# EAGLE schematic sa_io (EAGLE 9.5.1)
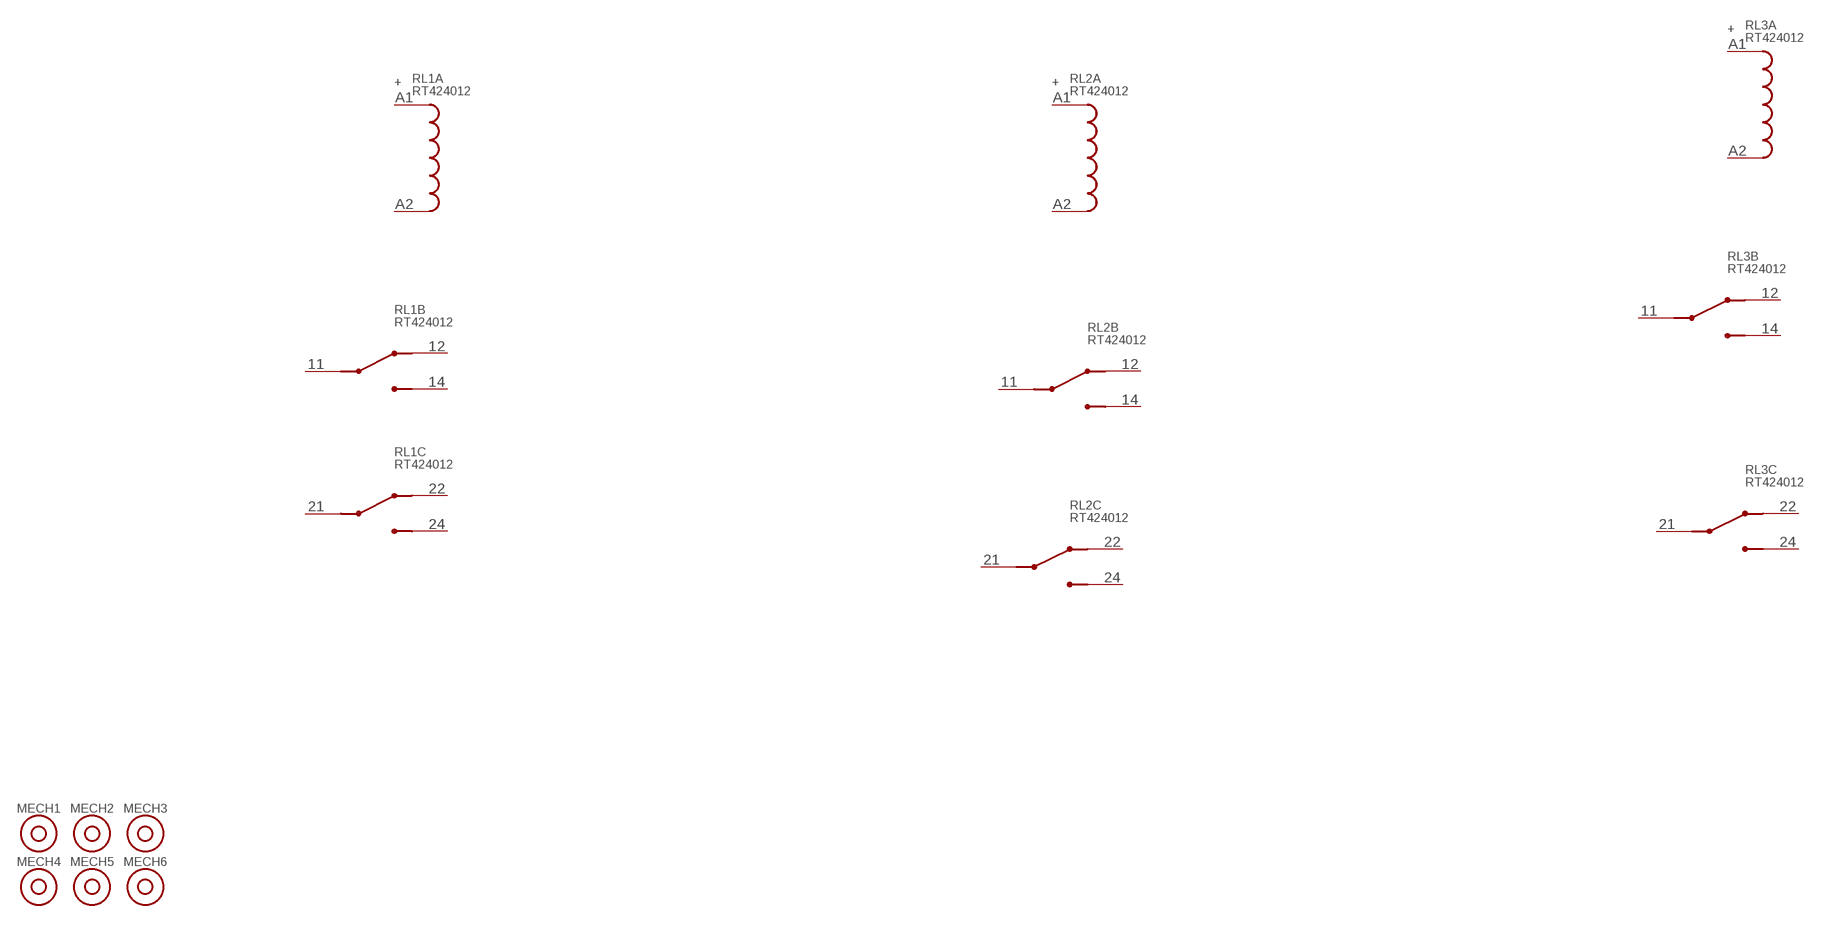
[diagram p0: schematic, sheet 1]

## Parts
MECH1  6mm x 3mm  MOUNTHOLE  [MOUNTHOLE_6X3]
MECH2  6mm x 3mm  MOUNTHOLE  [MOUNTHOLE_6X3]
MECH3  6mm x 3mm  MOUNTHOLE  [MOUNTHOLE_6X3]
MECH4  6mm x 3mm  MOUNTHOLE  [MOUNTHOLE_6X3]
MECH5  6mm x 3mm  MOUNTHOLE  [MOUNTHOLE_6X3]
MECH6  6mm x 3mm  MOUNTHOLE  [MOUNTHOLE_6X3]
RL1  RT424012  [30MMDPDTRELAY]
RL2  RT424012  [30MMDPDTRELAY]
RL3  RT424012  [30MMDPDTRELAY]
Unconnected: RL1.11 RL1.12 RL1.14 RL1.21 RL1.22 RL1.24 RL1.A1(A:A1) RL1.A2(A:A2) RL2.11 RL2.12 RL2.14 RL2.21 RL2.22 RL2.24 RL2.A1(A:A1) RL2.A2(A:A2) RL3.11 RL3.12 RL3.14 RL3.21 RL3.22 RL3.24 RL3.A1(A:A1) RL3.A2(A:A2)

## Library data of the parts
MECH1-MECH6 = MISC:MOUNTHOLE: Mechanical mounting hole.
RL1-RL3 = ELECTROMECH:RT424012: General Purpose Relay DPDT (2 Form C) 12VDC Coil Through Hole; DIGIKEY: PB967-ND; HEIGHT: 16; PRICE_PER: 1.83